# Altium schematic sheet DualDriver.SchDoc
size A
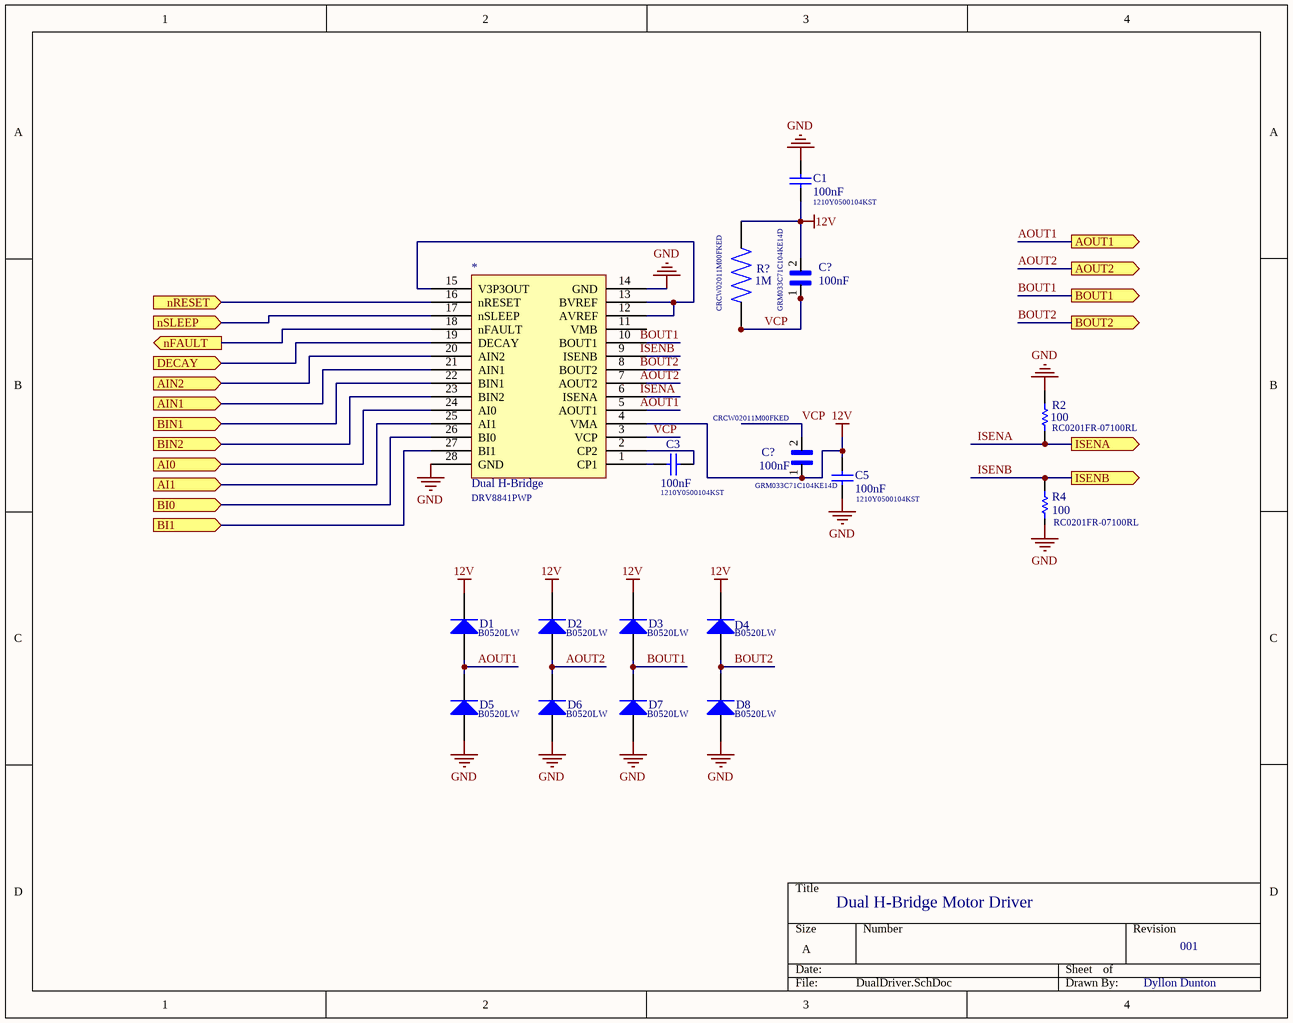
[diagram p0: DualDriver.SchDoc]

## Parts
(Parts that share a designator on the sheet are numbered #1, #2 ... from top to bottom, then left to right.)
*  Dual H-Bridge  [DIP_SW_8WAY_SMD]
C1  value 100nF  [C1210]  (hidden comment: Cap)
C3  value 100nF  [C1210]  (hidden comment: Cap)
C5  value 100nF  [C1210]  (hidden comment: Cap)
C?#1  value 100nF  [CAPC0603X33N]  (hidden comment: GRM033C71C104KE14D)
C?#2  value 100nF  [CAPC0603X33N]  (hidden comment: GRM033C71C104KE14D)
D1  Diode  [SMC]  (value not drawn)
D2  Diode  [SMC]  (value not drawn)
D3  Diode  [SMC]  (value not drawn)
D4  Diode  [SMC]  (value not drawn)
D5  Diode  [SMC]  (value not drawn)
D6  Diode  [SMC]  (value not drawn)
D7  Diode  [SMC]  (value not drawn)
D8  Diode  [SMC]  (value not drawn)
R2  value 100  [1812]  (hidden comment: Res1)
R4  value 100  [1812]  (hidden comment: Res1)
R?  value 1M  [RESC0603X28N]  (hidden comment: CRCW02011M00FKED)

## Ports
AI0 (in), AI1 (in), AIN1 (in), AIN2 (in), AOUT1 (out), AOUT2 (out), BI0 (in), BI1 (in), BIN1 (in), BIN2 (in), BOUT1 (out), BOUT2 (out), DECAY (in), ISENA (out), ISENB (out), nFAULT (out), nRESET (in), nSLEEP (in)

## Nets
12V: *.4(VMA) C1.1 C5.2 C?#1.2 C?#2.1 D1.2(K) D2.2(K) D3.2(K) D4.2(K) R?.2
GND: *.14(GND) *.28(GND) C1.2 C5.1 D5.1(A) D6.1(A) D7.1(A) D8.1(A) R2.2
AI0: *.24(AI0) ; port AI0
AI1: *.25(AI1) ; port AI1
AIN1: *.21(AIN1) ; port AIN1
AIN2: *.20(AIN2) ; port AIN2
AOUT1: D1.1(A) D5.2(K) ; port AOUT1
AOUT2: D2.1(A) D6.2(K) ; port AOUT2
BI0: *.26(BI0) ; port BI0
BI1: *.27(BI1) ; port BI1
BIN1: *.22(BIN1) ; port BIN1
BIN2: *.23(BIN2) ; port BIN2
BOUT1: D3.1(A) D7.2(K) ; port BOUT1
BOUT2: D4.1(A) D8.2(K) ; port BOUT2
DECAY: *.19(DECAY) ; port DECAY
ISENA: R2.1 ; port ISENA
ISENB: R4.2 ; port ISENB
nFAULT: *.18(nFAULT) ; port nFAULT
nRESET: *.16(nRESET) ; port nRESET
nSLEEP: *.17(nSLEEP) ; port nSLEEP
VCP: *.3(VCP) C?#1.1 C?#2.2 R?.1
Net*_1: *.1(CP1) C3.1
Net*_2: *.2(CP2) C3.2
Net*_12: *.12(AVREF) *.13(BVREF) *.15(V3P3OUT)

Not connected (* = marked no-connect by the designer): * 5(AOUT1) 6(ISENA) 7(AOUT2) 8(BOUT2) 9(ISENB) 10(BOUT1) 11(VMB); R4 1

## Notes on the sheet
- (near C1) 1210Y0500104KST
- (near R?) CRCW02011M00FKED
- (near C?#1) GRM033C71C104KE14D
- CRCW02011M00FKED
- (near R2) RC0201FR-07100RL
- (near *) DRV8841PWP
- (near C3) 1210Y0500104KST
- GRM033C71C104KE14D
- (near C5) 1210Y0500104KST
- (near R4) RC0201FR-07100RL
- (near D1) B0520LW
- (near D2) B0520LW
- (near D3) B0520LW
- (near D4) B0520LW
- (near D5) B0520LW
- (near D6) B0520LW
- (near D7) B0520LW
- (near D8) B0520LW
- Dual H-Bridge Motor Driver
- 001
- Dyllon Dunton
- Labels drawn without touching a wire or pin: AOUT1, AOUT2, BOUT1, BOUT2, GND, ISENA, ISENB

## Library data of the parts
* = Component_1
C1 C3 C5 = Cap: Capacitor; Published: 8-Jun-2000; LatestRevisionDate: 17-Jul-2002; LatestRevisionNote: Re-released for DXP Platform.; PackageReference: RAD-0.3; Publisher: Altium Limited; PackageDescription: Radial Cap, Thru-Hole; 2 Leads; 0.3 in Pin Spacing
C?#1 C?#2 = GRM033C71C104KE14D: SMD Capacitor X7S(EIA) with Capacitance: 0.10uF Tol. 10%. Rated Voltage: 16Vdc; MF: Murata; SnapEDA_Link: https://www.snapeda.com/parts/GRM033C71C104KE14D/Murata/view-part/?ref=snap; Package: 0603 Taiyo Yuden; Check_prices: https://www.snapeda.com/parts/GRM033C71C104KE14D/Murata/view-part/?ref=eda; MP: GRM033C71C104KE14D; Availability: In Stock; Purchase-URL: https://pricing.snapeda.com/search/part/GRM033C71C104KE14D/?ref=eda; Price: None
D1-D8 = Diode: Default Diode; Published: 8-Jun-2000; LatestRevisionDate: 17-Jul-2002; LatestRevisionNote: Re-released for DXP Platform.; PackageVersion: Sep-1996; PackageReference: SMC; Publisher: Altium Limited; PackageDescription: DO-214-AB/SMC; 2 C-Bend Leads; Body 7.9 x 5.9 mm, inc. leads (LxW); Code_JEDEC: DO-214-AB
R2 R4 = Res1: Resistor; Published: 8-Jun-2000; LatestRevisionDate: 17-Jul-2002; LatestRevisionNote: Re-released for DXP Platform.; PackageReference: AXIAL-0.3; Publisher: Altium Limited; PackageDescription: Axial Device, Thru-Hole; 2 Leads; 0.3 in Pin Spacing
R? = CRCW02011M00FKED: 1 MOhms Â±1% 0.05W, 1/20W Chip Resistor 0201 (0603 Metric) Thick Film; MF: Vishay / Dale; SnapEDA_Link: https://www.snapeda.com/parts/CRCW02011M00FKED/Dale/view-part/?ref=snap; MP: CRCW02011M00FKED; Package: None; Check_prices: https://www.snapeda.com/parts/CRCW02011M00FKED/Dale/view-part/?ref=eda; Purchase-URL: https://pricing.snapeda.com/search/part/CRCW02011M00FKED/?ref=eda; Digi-Key_Part_Number: 541-1.00MAABTR-ND